# EAGLE design manual_motors (EAGLE 8.6.0)
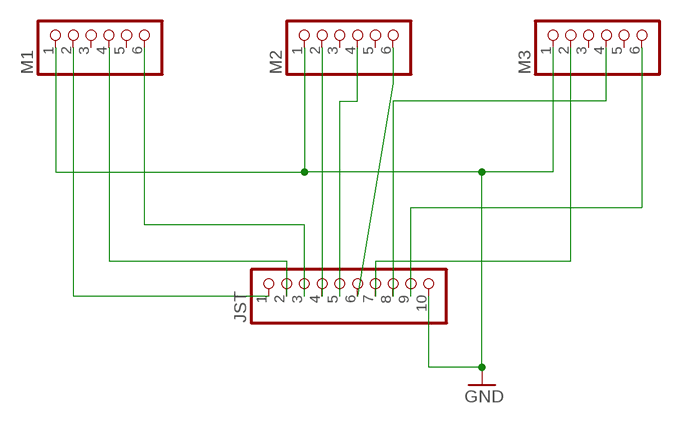
[diagram p0: schematic, sheet 1]

## Parts
JST  PINHD-1X10  [1X10]
M1  PINHD-1X6  [1X06]
M2  PINHD-1X6  [1X06]
M3  PINHD-1X6  [1X06]

## Nets
GND: JST.10 M1.1 M2.1 M3.1
N$1: JST.1 M1.2
N$2: JST.4 M2.2
N$3: JST.5 M2.4
N$4: JST.6 M2.6
N$6: JST.9 M3.6
N$7: JST.2 M1.4
N$9: JST.8 M3.4
N$10: JST.7 M3.2
N$11: JST.3 M1.6
Unconnected: M1.3 M1.5 M2.3 M2.5 M3.3 M3.5

## Library data of the parts
JST = pinhead:PINHD-1X10: PIN HEADER
M1-M3 = pinhead:PINHD-1X6: PIN HEADER

## Board
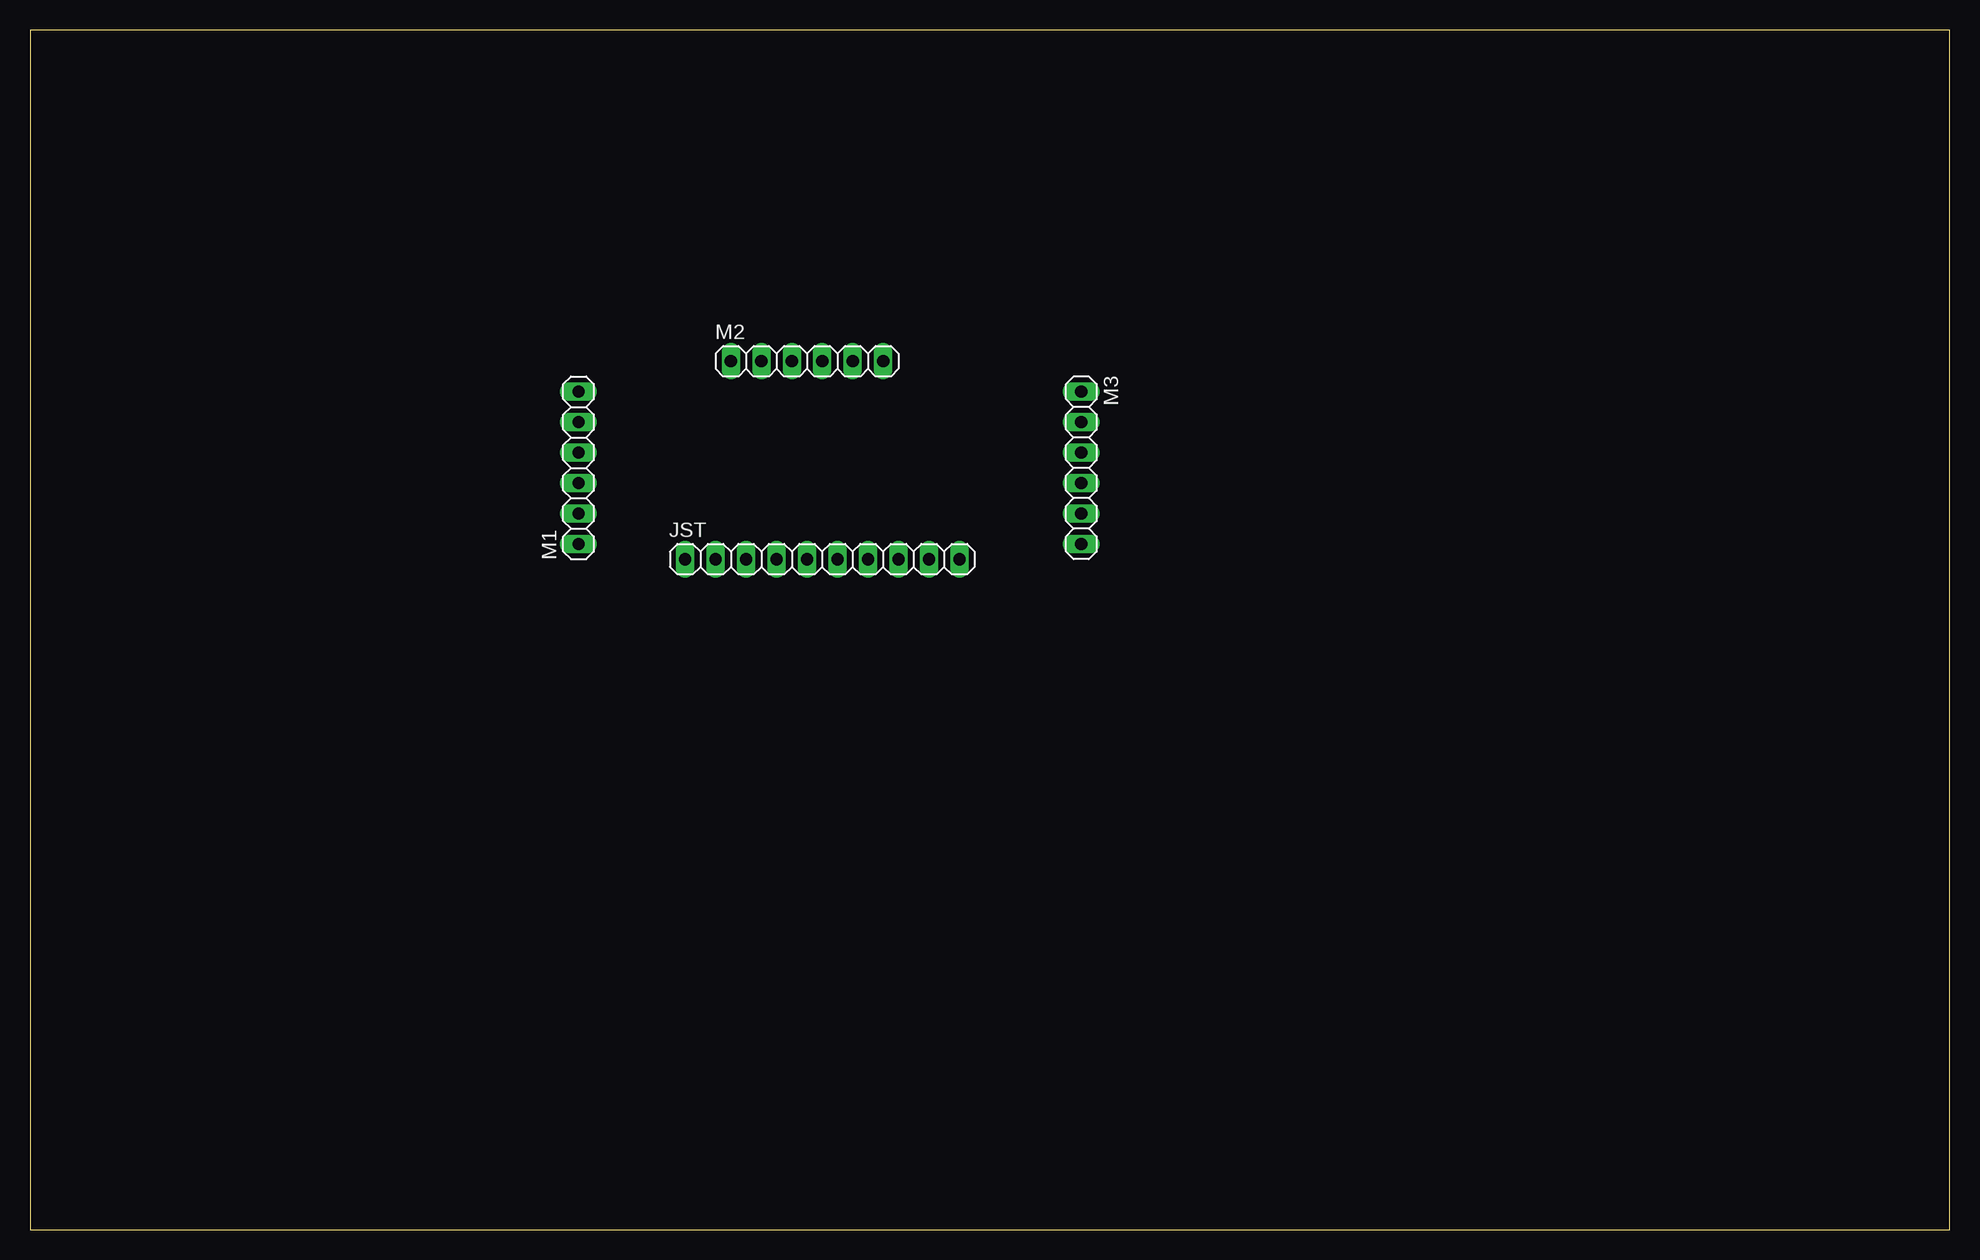
[diagram p1: board, top side]
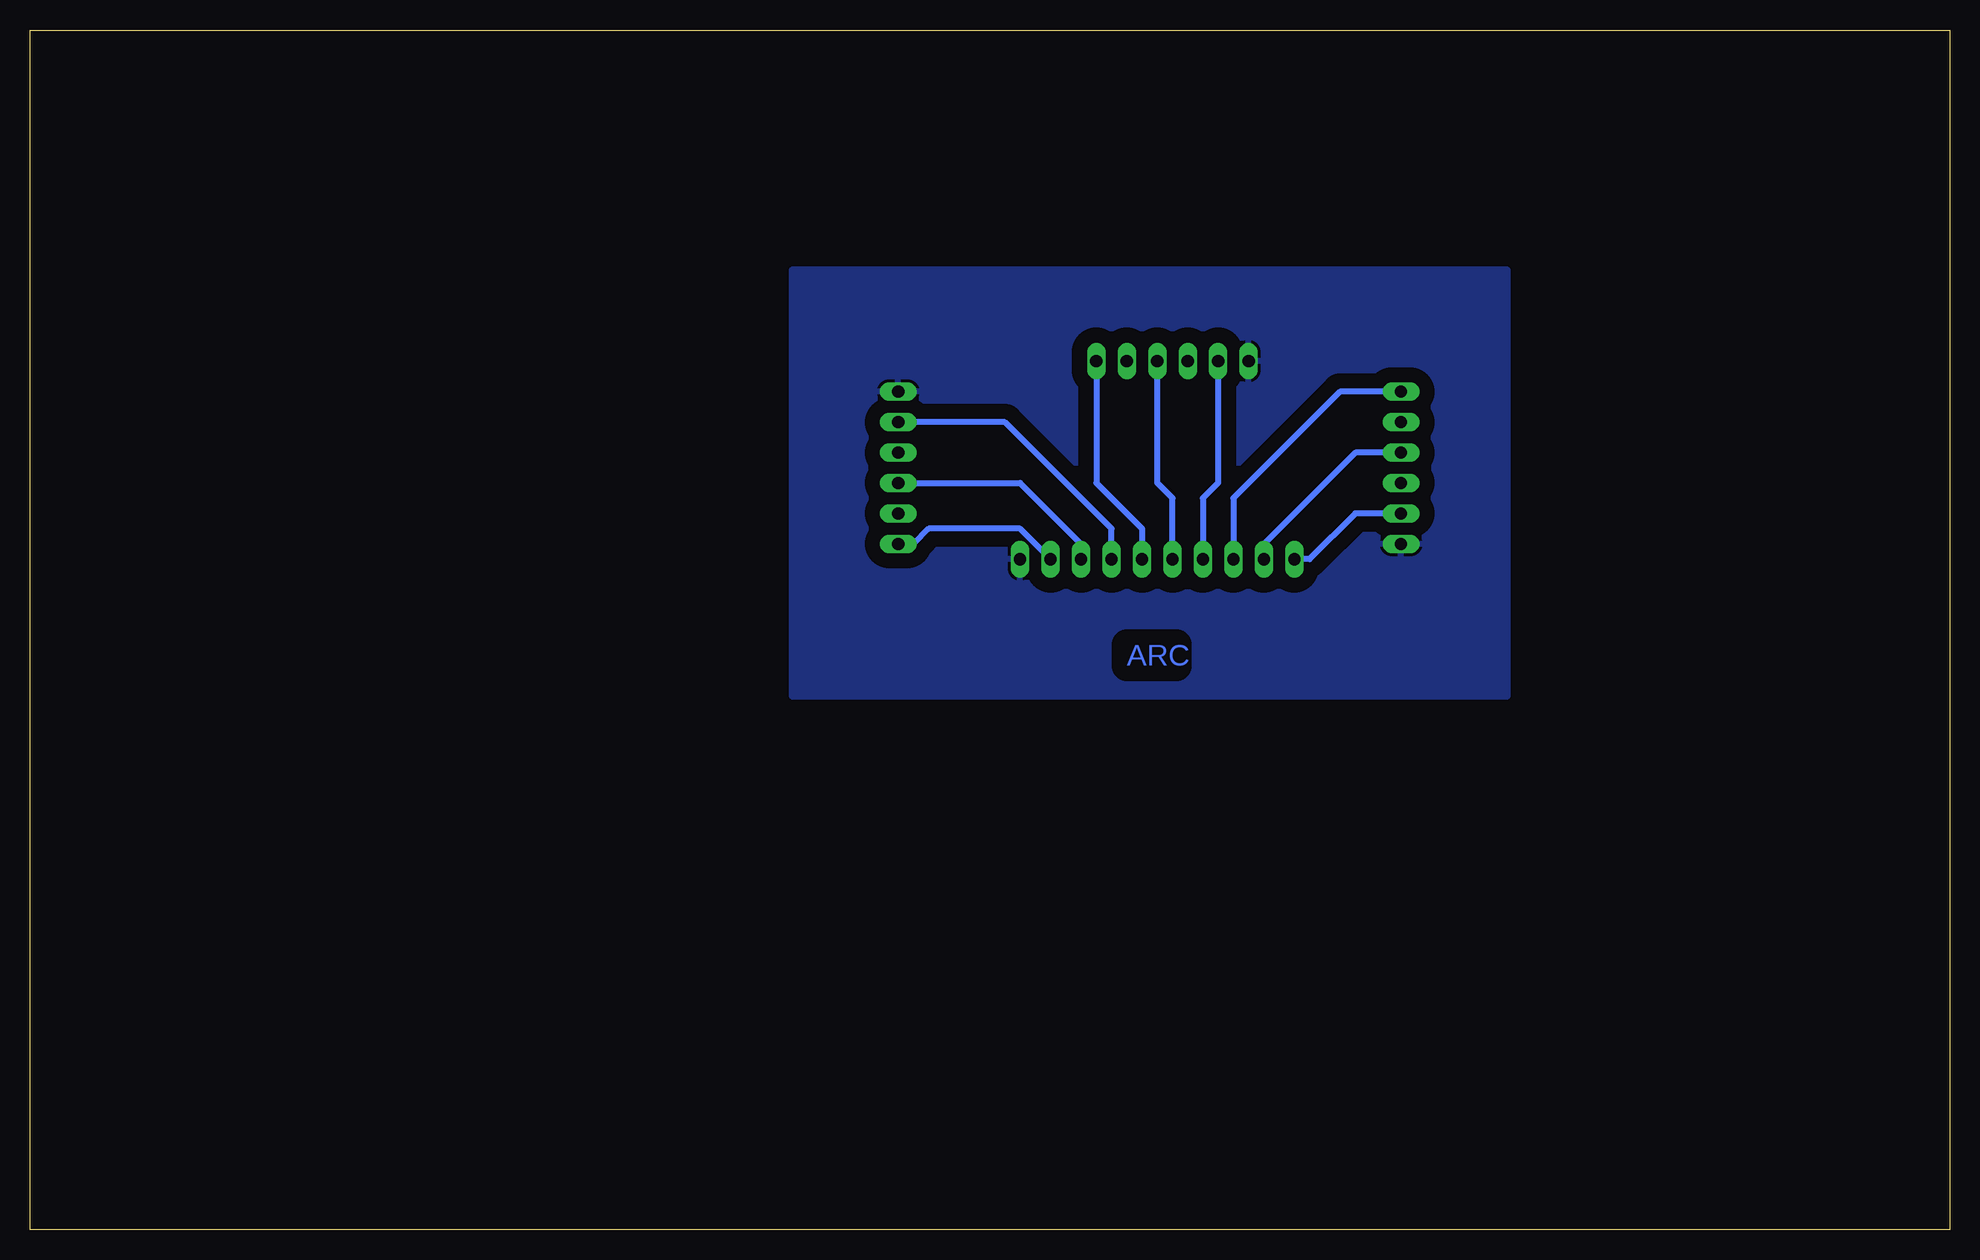
[diagram p2: board, bottom side, seen from below]

Size 160 x 100 mm. Coordinates in mm from the lower left corner, seen from the top.
Outline: 0,0 160,0 160,100 0,100 0,0
Copper layers (1*16): Top 0.035mm / dielectric 1.5mm / Bottom 0.035mm
Design rules "default": minimum track width 6mil, minimum drill 0.35mm, track to track 6mil, track to pad 6mil, pad to pad 6mil, via to via 6mil, smd to smd 6mil, copper to edge 40mil, drill to drill 6mil, minimum pad ring 10mil, minimum via ring 8mil, stop-mask expansion 4mil, vias tented up to drill 0mil, thermal gap 10mil

### Footprints (pad centres in the part's own frame; a part is rotated, then mirrored left to right if it is on the bottom)
1X10 = drill 1.016 long: 1 -11.43,0; 2 -8.89,0; 3 -6.35,0; 4 -3.81,0; 5 -1.27,0; 6 1.27,0; 7 3.81,0; 8 6.35,0; 9 8.89,0; 10 11.43,0
1X06 = drill 1.016 long: 1 -6.35,0; 2 -3.81,0; 3 -1.27,0; 4 1.27,0; 5 3.81,0; 6 6.35,0

### Placement (x,y rotation side)
JST  66.04,55.88 0 top
M1  45.72,63.5 90 top
M2  64.77,72.39 0 top
M3  87.63,63.5 270 top

### Tracks (layer width: path | path; a pad name or v marks a point on that pad's centre or on a via)
GND
  pour Bottom (isolate 1.27): 36.83,80.01 96.52,80.01 96.52,44.45 36.83,44.45
N$1
  Bottom 0.508: M1.2 49.53,59.69 53.34,55.88 JST.1
N$2
  Bottom 0.508: M2.2 60.96,62.23 62.23,60.96 JST.4
N$3
  Bottom 0.508: JST.5 64.77,60.96 66.04,62.23 M2.4
N$4
  Bottom 0.508: M2.6 71.12,62.23 67.31,58.42 JST.6
N$6
  Bottom 0.508: JST.9 77.47,58.42 85.09,58.42 86.36,57.15 M3.6
N$7
  Bottom 0.508: M1.4 49.53,64.77 57.15,57.15 JST.2
N$9
  Bottom 0.508: JST.8 72.39,57.15 77.47,62.23 M3.4
N$10
  Bottom 0.508: JST.7 69.85,58.42 78.74,67.31 M3.2
N$11
  Bottom 0.508: M1.6 50.8,69.85 59.69,60.96 JST.3

### Text on the board
Bottom: ARC